# Altium project BLUENRG-345_REV1_PT1.PrjPcb
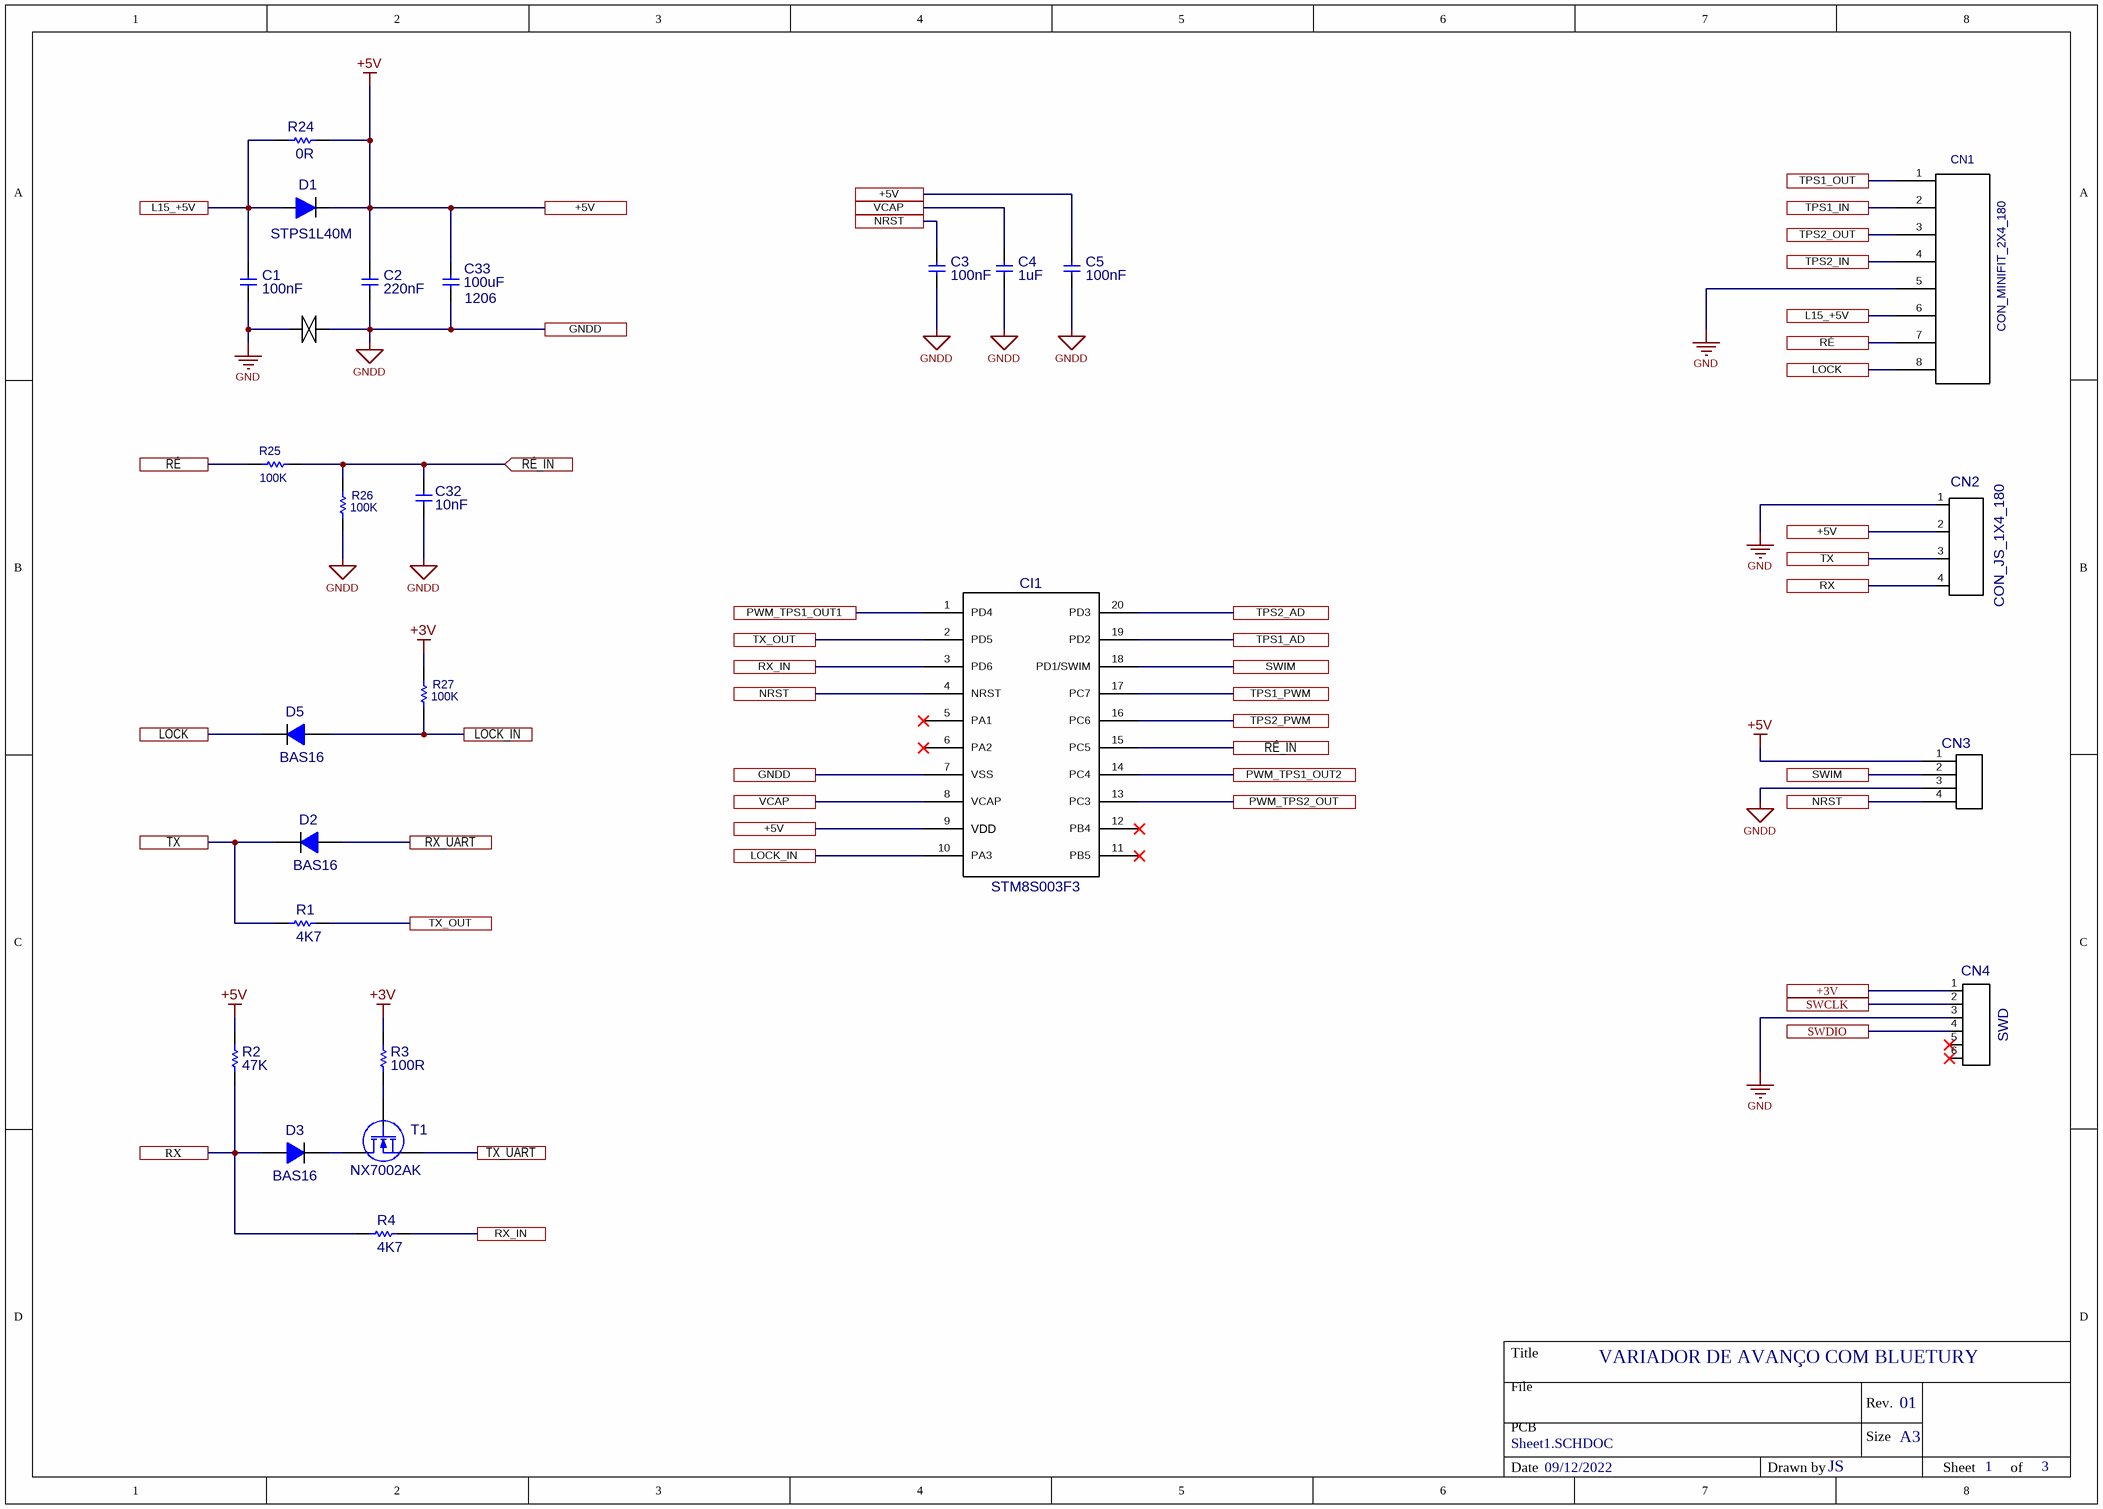
[diagram p0: BLUENRG-345_REV1_Sheet1.SchDoc]
Date: 09/12/2022; DrawnBy: JS; Revision: 01; Title: VARIADOR DE AVANÇO COM BLUETURY
3 sheets, 82 parts. Net scope: flat (ports and power ports of the same name join across sheets).
Board files: BLUENRG-345_REV1_PAINEL.PcbDoc, BLUENRG-345_REV1_PT1_UN.PcbDoc
Sheets:
  BLUENRG-345_REV1_Sheet1.SchDoc
  BLUENRG-345_REV1_Sheet2.SchDoc
  BLUENRG-345_REV1_Sheet3.SchDoc

## Sheet BLUENRG-345_REV1_Sheet1.SchDoc: VARIADOR DE AVANÇO COM BLUETURY
size A3; Date: 09/12/2022; Author: FELIPE; DrawnBy: JS; DocumentNumber: 1; Revision: 01; SheetNumber: 1; SheetTotal: 3; DocumentName: Sheet1.SCHDOC

### Parts
C1  value 100nF  [C0402_REV1]  (hidden comment: C0402)
C2  value 220nF  [C0402_REV1]  (hidden comment: C0402)
C3  value 100nF  [C0402_REV1]  (hidden comment: C0402)
C4  value 1uF  [C0402_REV1]  (hidden comment: C0402)
C5  value 100nF  [C0402_REV1]  (hidden comment: C0402)
C32  value 10nF  [C0402_REV1]  (hidden comment: C0402)
C33  value 100uF  Encapsulamento: 1206  [C1206_rev1]  (hidden comment: C1206)
CI1  value STM8S003F3  [TSSOP20]  (hidden comment: CI_STM8S003F3_TSSOP20)
CN1  CON_MINIFIT_2X4_180  [CONECTOR_MINIFIT_2X4_180]
CN2  CON_JS_1X4_180  [CONECTOR_ 1x4 2.0mm - 180°]
CN3  CON_BP1X4_180  [CONECTOR_BP1X4_SWIM_180]  (value not drawn)
CN4  value SWD  [CONECTOR_BP1X6_180]  (hidden comment: CON_BP1X6_180)
D1  value STPS1L40M  [DO216AA_REV1]  (hidden comment: D_STPS1L40M_DO216AA)
D2  value BAS16  [SOD323_IPC]  (hidden comment: D_BAS16_SOD323)
D3  value BAS16  [SOD323_IPC]  (hidden comment: D_BAS16_SOD323)
D5  value BAS16  [SOD323_IPC]  (hidden comment: D_BAS16_SOD323)
NT1  NET TIE 30mils  [NET TIE 30mils]  (value not drawn)  (net tie, no BOM)
R1  value 4K7  [R0402_REV1]  (hidden comment: RES 0402 4K7 1/16W 5%)
R2  value 47K  [R0402_REV1]  (hidden comment: R0603)
R3  value 100R  [R0402_REV1]  (hidden comment: R0603)
R4  value 4K7  [R0402_REV1]  (hidden comment: RES 0402 4K7 1/16W 5%)
R24  value 0R  [R0402_REV1]  (hidden comment: RES 0402 0R 1/16W 5%)
R25  value 100K  [R0402_REV1]  (hidden comment: R0402)
R26  value 100K  [R0402_REV1]  (hidden comment: R0402)
R27  value 100K  [R0402_REV1]  (hidden comment: R0402)
T1  NX7002AK  [SOT23_REV1]

### Ports
+3V, +5V, GNDD, L15_+5V, LOCK, LOCK_IN, NRST, PWM_TPS1_OUT1, PWM_TPS1_OUT2, PWM_TPS2_OUT, RX, RX_IN, RX_UART, RÉ, RÉ_IN, RÉ_IN (in), SWCLK, SWDIO, SWIM, TPS1_AD, TPS1_IN, TPS1_OUT, TPS1_PWM, TPS2_AD, TPS2_IN, TPS2_OUT, TPS2_PWM, TX, TX_OUT, TX_UART, VCAP

### Nets
+3V: CN4.1 R3.2 R27.1 ; port +3V
+5V: C2.1 C5.1(+) C33.2 CI1.9(VDD) CN2.2 CN3.1 D1.1(K) R2.2 R24.1 ; port +5V
GND: C1.2(-) CN1.5 CN2.1 CN4.3 NT1.2
GNDD: C2.2 C3.2(-) C4.2 C5.2(-) C32.1 C33.1 CI1.7(VSS) CN3.3 NT1.1 R26.2 ; port GNDD
L15_+5V: C1.1(+) CN1.6 D1.2(A) R24.2 ; port L15_+5V
LOCK: CN1.8 D5.2(K) ; port LOCK
LOCK_IN: CI1.10(PA3) D5.1(A) R27.2 ; port LOCK_IN
NRST: C3.1(+) CI1.4(NRST) CN3.4 ; port NRST
PWM_TPS1_OUT1: CI1.1(PD4) ; port PWM_TPS1_OUT1
PWM_TPS1_OUT2: CI1.14(PC4) ; port PWM_TPS1_OUT2
PWM_TPS2_OUT: CI1.13(PC3) ; port PWM_TPS2_OUT
RX: CN2.4 D3.1(A) R2.1 R4.1 ; port RX
RX_IN: CI1.3(PD6) R4.2 ; port RX_IN
RX_UART: D2.1(A) ; port RX_UART
RÉ: CN1.7 R25.2 ; port RÉ
RÉ_IN: C32.2 CI1.15(PC5) R25.1 R26.1 ; port RÉ_IN
SWCLK: CN4.2 ; port SWCLK
SWDIO: CN4.4 ; port SWDIO
SWIM: CI1.18(PD1/SWIM) CN3.2 ; port SWIM
TPS1_AD: CI1.19(PD2) ; port TPS1_AD
TPS1_IN: CN1.2 ; port TPS1_IN
TPS1_OUT: CN1.1 ; port TPS1_OUT
TPS1_PWM: CI1.17(PC7) ; port TPS1_PWM
TPS2_AD: CI1.20(PD3) ; port TPS2_AD
TPS2_IN: CN1.4 ; port TPS2_IN
TPS2_OUT: CN1.3 ; port TPS2_OUT
TPS2_PWM: CI1.16(PC6) ; port TPS2_PWM
TX: CN2.3 D2.2(K) R1.1 ; port TX
TX_OUT: CI1.2(PD5) R1.2 ; port TX_OUT
TX_UART: T1.2(S) ; port TX_UART
VCAP: C4.1 CI1.8(VCAP) ; port VCAP
NetD3_2: D3.2(K) T1.3(D)
NetR3_1: R3.1 T1.1(G)

Not connected (* = marked no-connect by the designer): CI1 5(PA1)* 6(PA2)* 11(PB5)* 12(PB4)*; CN4 5* 6*

### Notes on the sheet
- Title
- File
- PCB
- Rev.
- Size
- A3
- Date
- Drawn by
- Sheet
- of

### Library data of the parts
C1 C3 C5 = CAP_0402 100nF 10% 50V X7R: CAPACITOR 0402 100NF / 50V X7R 10%; Partnumber Fabricante 01: GCM155R71H104KE02D; Código Tury: 002.00.00015; Tipo de Montagem: SMD; Fabricante 01: MURATA; Fabricante 02: YAGEO; Partnumber Fabricante 02: CC0402KRX5R9BB104
C2 = CAP_0402 220nF 10% 16V X7R: CAPACITOR 0402 220NF / 16V X7R 10%; Partnumber Fabricante 01: GRM155R71H224KA12D; Tipo de Montagem: SMD; Código Tury: 002.00.00014; Fabricante 01: MURATA; Fabricante 02: YAGEO; Fabricante 03: TAIYO-YUDEN; Partnumber Fabricante 02: CC0402KRX7R8BB224; Partnumber Fabricante 03: UMK105BJ224KV-F
C4 = CAP_0402 1uF 10% 16V X6S: CAPACITOR 0402 1UF / 16V X6S 10%; Partnumber Fabricante 01: EMK105C6105KV-F; Tipo de Montagem: SMD; Código Tury: 002.00.00009; Fabricante 01: TAIYO-YUDEN; Fabricante 02: YAGEO; Fabricante 03: TDK; Partnumber Fabricante 02: CC0402KRX6S7BB105; Partnumber Fabricante 03: C1005X6S1C105K050BC
C32 = CAP 0603 47nF 50V X7R 10%: CAPACITOR 0402 10NF / 25V X7R 5%; Partnumber Fabricante 01: GRM155R71E103JA01J; Código Tury: 002.00.00007; Tipo de Montagem: SMD; Fabricante 01: MURATA; Fabricante 02: YAGEO; Fabricante 03: YAGEO; Partnumber Fabricante 02: CC0402KRX7R8BB103; Partnumber Fabricante 03: CC0402JRX7R8BB103
C33 = CAP_1206 100uF 6V3 X5R 20%: CAPACITOR 1206 100UF / 6V3 X5R 20%; Partnumber Fabricante 01: GMC31X5R107M6R3NT; Código Tury: 002.03.00006; Tipo de Montagem: SMD; Fabricante 01: CAL-CHIP ELECTRONICS, INC.
CI1 = CI_STM8S003F3_TSSOP20: CI MICROCONTROLADOR STM8S003F3P6; Partnumber Fabricante 01: STM8S003F3P6TR; Código Tury: 004.07.00026; Tipo de Montagem: SMD; Fabricante 01: ST
CN1 = CONECTOR_MINIFIT_2X4_180_PT: CONECTOR PCI - POTENCIA MINIFIT PT 180° 2X4X4,2MM; Tipo de Montagem: PTH; Código Tury: 014.11.00221; Value: *
CN2 = CONECTOR_JS_1X4_180: CONECTOR PCI - SINAL 180° - 1X4X2,0MM; Partnumber Fabricante 01: LW-2002P0400T; Tipo de Montagem: PTH; Código Tury: 014.10.00819; Fabricante 01: LANDWIN; Value: *
CN3 = CON_BPT_1X4_180: BARRA DE PINO - SECAO QUADRADA 180º 1X4X2,54MM; Part Number: 013.07.00104; Tipo de Montagem: PTH
CN4 = CONECTOR_BP1X6_180: Conector barra de pinos 1x6 180º; Part Number: 013.07.00108
D1 = D_STPS1L40M_DO216AA: DIODO SCHOTTKY STPS1L40M DO2126-AA; Código Tury: 005.04.00002; Tipo de Montagem: SMD
D2 D3 D5 = D_BAS16_SOD323: DIODO DE SINAL BAS16 SOD323; Partnumber Fabricante 01: BAS316; Tipo de Montagem: SMD; Código Tury: 005.00.00010; Fabricante 01: NXP; Fabricante 02: ON; Fabricante 03: VISHAY; Partnumber Fabricante 02: BAS16HT1G; Partnumber Fabricante 03: BAS16WS
NT1 = NET TIE 30mils: Value: {Value}
R1 R4 = RES 0402 4K7 1/16W 5%: RESISTOR 0402 4K7 1/16W 5%; Partnumber Fabricante 01: CRCW04024K70JNED; Código Tury: 001.00.00009; Encapsulamento: 0402; Tipo de Montagem: SMD; Fabricante 02: VIKING; Fabricante 01: VISHAY; Fabricante 03: WALSIN; Partnumber Fabricante 02: CR-02JL6---4K7; Partnumber Fabricante 03: WR04X472JTL
R2 = RES 0402 47K 1/16W 5%: RESISTOR 0402 47K 1/16W 5%; Partnumber Fabricante 01: CRCW040247K0JNEDHP; Encapsulamento: 0402; Tipo de Montagem: SMD; Código Tury: 001.00.00006; Fabricante 01: VISHAY; Fabricante 02: VIKING; Fabricante 03: HOTTECH; Partnumber Fabricante 02: CR-02JL6--47K; Partnumber Fabricante 03: RI0402L473JT
R3 = RES 0402 100R 1/16W 5%: RESISTOR 0402 100R 1/16W 5%; Partnumber Fabricante 01: CR0402AJW-101GAS; Encapsulamento: 0402; Tipo de Montagem: SMD; Código Tury: 001.00.00001; Fabricante 01: BOURNS; Fabricante 02: VIKING; Fabricante 03: WALSIN; Partnumber Fabricante 02: CR-02JL6--100R; Partnumber Fabricante 03: WR04X101JTL
R24 = RES 0402 0R 1/16W 5%: RESISTOR 0402 0R 1/16W 5%; Partnumber Fabricante 01: RC0402JR-070RL; Encapsulamento: 0402; Tipo de Montagem: SMD; Código Tury: 001.00.00024; Fabricante 01: YAGEO; Fabricante 02: WALSIN; Partnumber Fabricante 02: MR04X000PTL
R25-R27 = RES 0402 100K 1/16W 5%: RESISTOR 0402 100K 1/16W 5%; Partnumber Fabricante 01: CRCW0402100KJNED; Encapsulamento: 0402; Tipo de Montagem: SMD; Código Tury: 001.00.00005; Fabricante 01: VISHAY; Fabricante 02: VIKING; Fabricante 03: WALSIN; Partnumber Fabricante 02: CR-02JL6--100K; Partnumber Fabricante 03: WR04X104JTL
T1 = T_NX7002AK: TRANSISTOR MOSFET CANAL N 60V ,19A NX7002AK; Tipo de Montagem: SMD; Código Tury: 006.06.00013; Value: NX7002AK

## Sheet BLUENRG-345_REV1_Sheet2.SchDoc: VARIADOR DE AVANÇO COM BLUETURY
size A3; Date: 09/12/2022; Author: FELIPE; DrawnBy: JS; DocumentNumber: 2; Revision: 01; SheetNumber: 2; SheetTotal: 3; DocumentName: Sheet2.SCHDOC
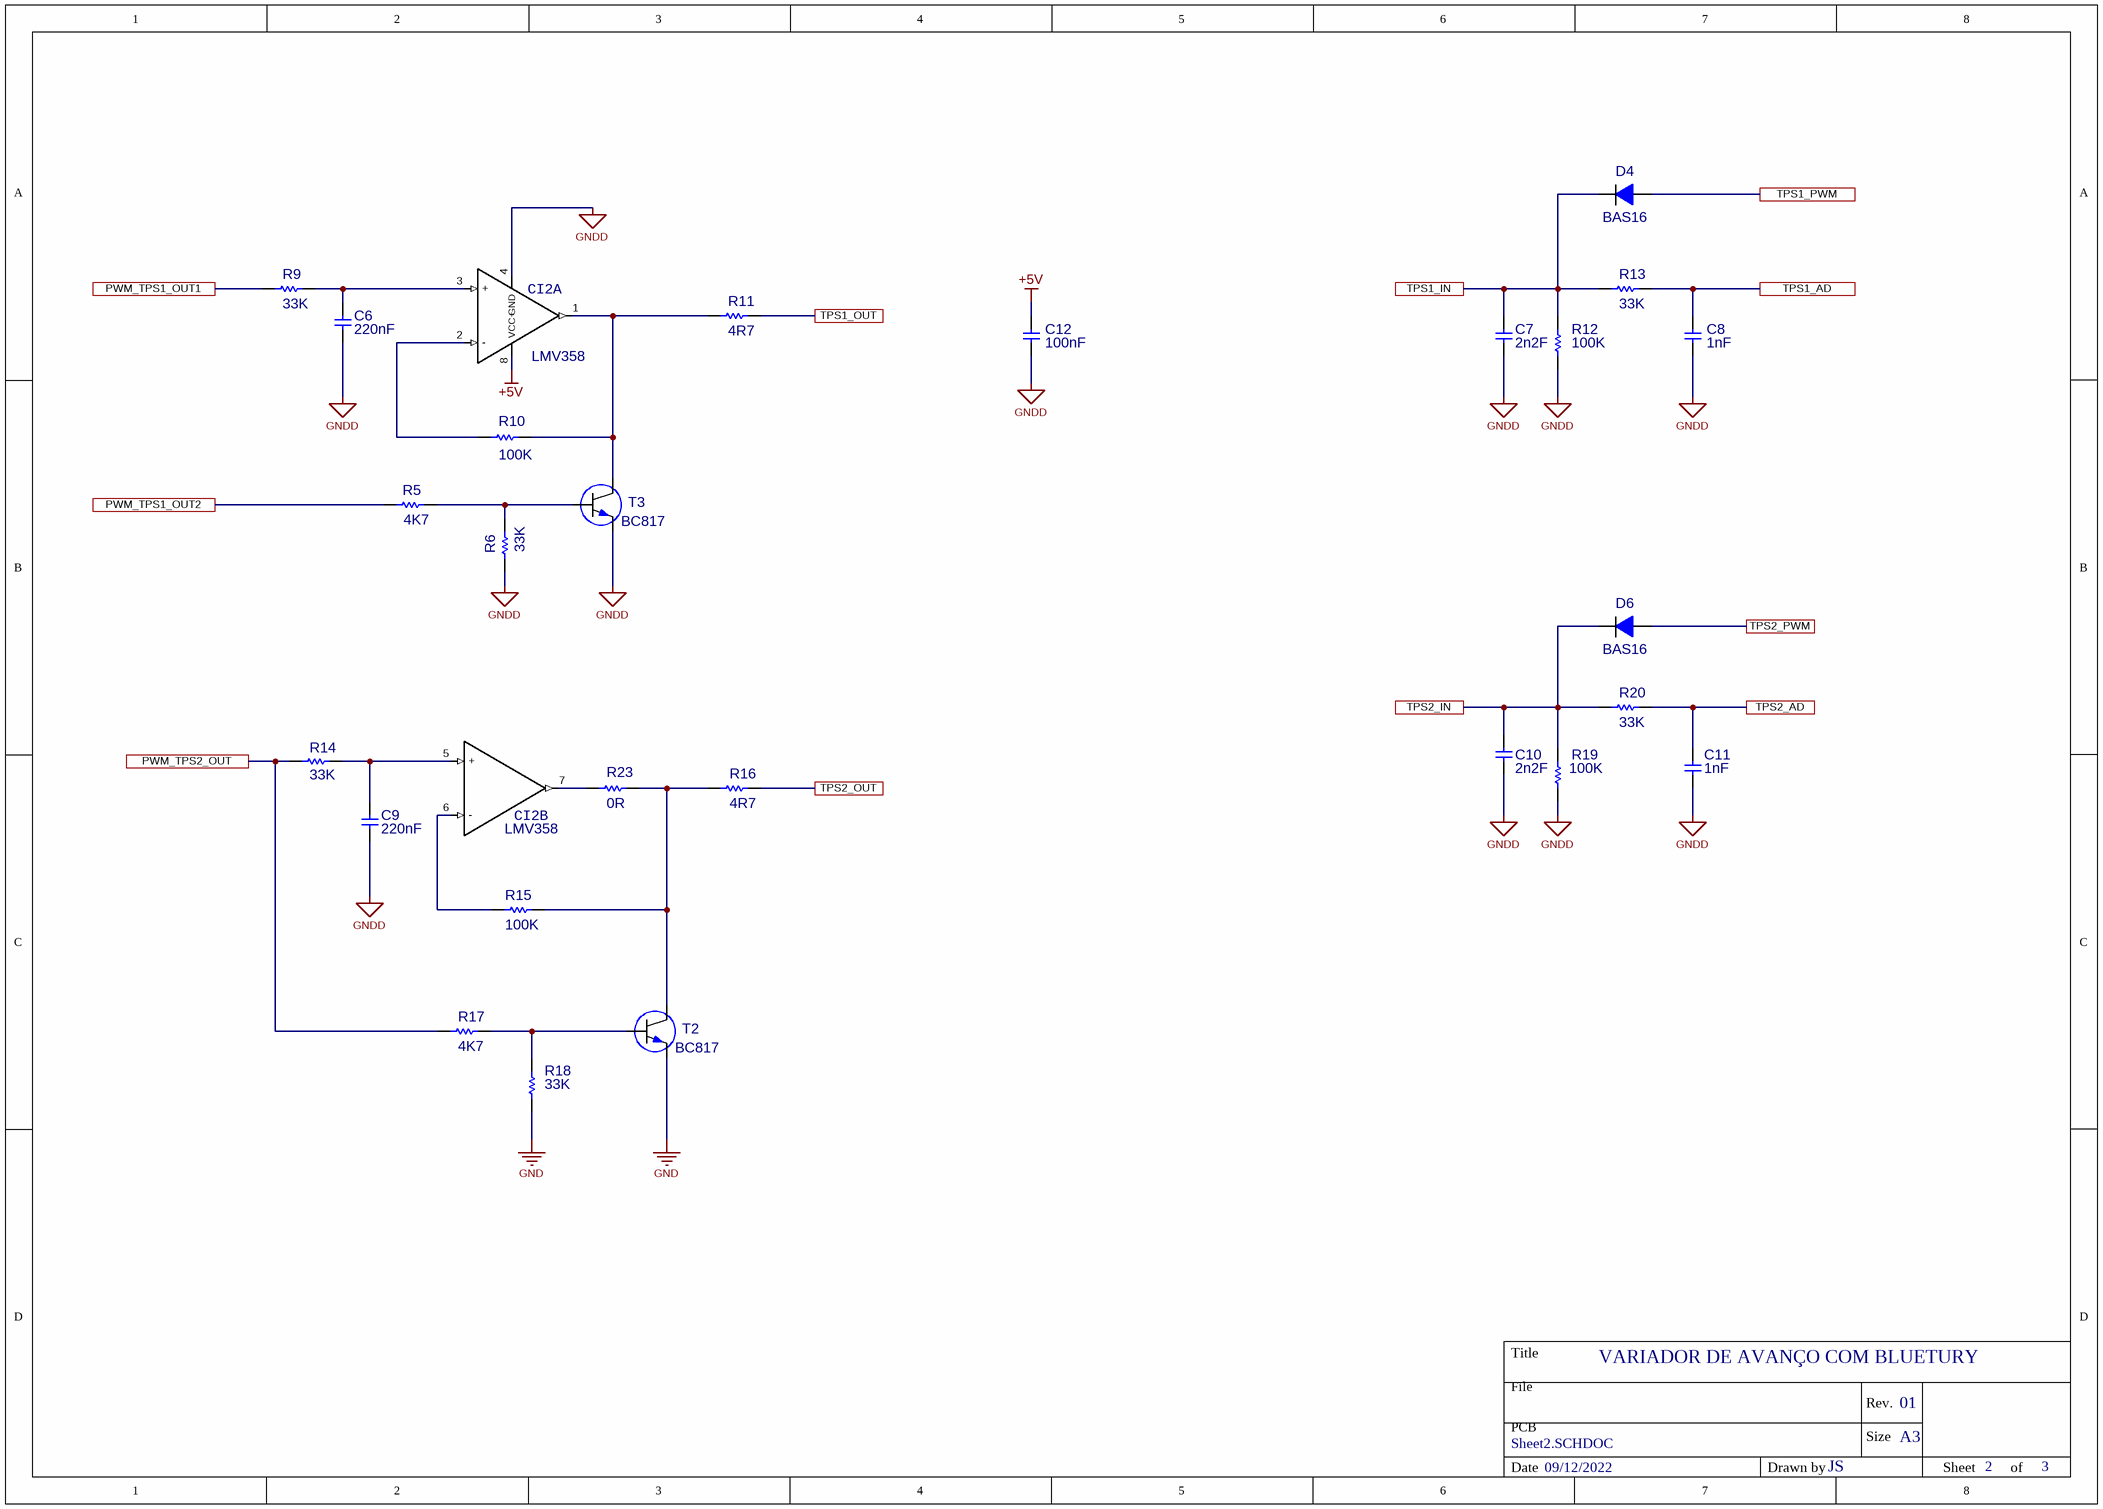
[diagram p1: BLUENRG-345_REV1_Sheet2.SchDoc]

### Parts
C6  value 220nF  [C0402_REV1]  (hidden comment: C0402)
C7  value 2n2F  [C0402_REV1]  (hidden comment: C0402)
C8  value 1nF  [C0402_REV1]  (hidden comment: C0402)
C9  value 220nF  [C0402_REV1]  (hidden comment: C0402)
C10  value 2n2F  [C0402_REV1]  (hidden comment: C0402)
C11  value 1nF  [C0402_REV1]  (hidden comment: C0402)
C12  value 100nF  [C0402_REV1]  (hidden comment: C0402)
CI2  value LMV358  [TSSOP-8_REV1 - MINISO8]  (hidden comment: CI_LMV358_TSSOP8)  (parts A,B of 2)
D4  value BAS16  [SOD323_IPC]  (hidden comment: D_BAS16_SOD323)
D6  value BAS16  [SOD323_IPC]  (hidden comment: D_BAS16_SOD323)
R5  value 4K7  [R0402_REV1]  (hidden comment: RES 0402 4K7 1/16W 5%)
R6  value 33K  [R0402_REV1]  (hidden comment: R0603)
R9  value 33K  [R0402_REV1]  (hidden comment: R0603)
R10  value 100K  [R0402_REV1]  (hidden comment: R0402)
R11  value 4R7  [R0402_REV1]  (hidden comment: RES 0402 4R7 1/16W 5%)
R12  value 100K  [R0402_REV1]  (hidden comment: R0402)
R13  value 33K  [R0402_REV1]  (hidden comment: R0603)
R14  value 33K  [R0402_REV1]  (hidden comment: R0603)
R15  value 100K  [R0402_REV1]  (hidden comment: R0402)
R16  value 4R7  [R0402_REV1]  (hidden comment: RES 0402 4R7 1/16W 5%)
R17  value 4K7  [R0402_REV1]  (hidden comment: RES 0402 4K7 1/16W 5%)
R18  value 33K  [R0402_REV1]  (hidden comment: R0603)
R19  value 100K  [R0402_REV1]  (hidden comment: R0402)
R20  value 33K  [R0402_REV1]  (hidden comment: R0603)
R23  value 0R  [R0402_REV1]  (hidden comment: RES 0402 0R 1/16W 5%)
T2  BC817  [SOT23_REV1]
T3  BC817  [SOT23_REV1]

### Ports
PWM_TPS1_OUT1, PWM_TPS1_OUT2, PWM_TPS2_OUT, TPS1_AD, TPS1_IN, TPS1_OUT, TPS1_PWM, TPS2_AD, TPS2_IN, TPS2_OUT, TPS2_PWM

### Nets
+5V: C12.2(-) CI2.8(VCC+)
GND: R18.1 T2.2(E)
GNDD: C6.1 C7.2 C8.2 C9.1 C10.2 C11.2 C12.1(+) CI2.4(GND) R6.1 R12.1 R19.1 T3.2(E)
PWM_TPS1_OUT1: R9.1 ; port PWM_TPS1_OUT1
PWM_TPS1_OUT2: R5.1 ; port PWM_TPS1_OUT2
PWM_TPS2_OUT: R14.1 R17.1 ; port PWM_TPS2_OUT
TPS1_AD: C8.1 R13.2 ; port TPS1_AD
TPS1_IN: C7.1 D4.2(K) R12.2 R13.1 ; port TPS1_IN
TPS1_OUT: R11.2 ; port TPS1_OUT
TPS1_PWM: D4.1(A) ; port TPS1_PWM
TPS2_AD: C11.1 R20.2 ; port TPS2_AD
TPS2_IN: C10.1 D6.2(K) R19.2 R20.1 ; port TPS2_IN
TPS2_OUT: R16.2 ; port TPS2_OUT
TPS2_PWM: D6.1(A) ; port TPS2_PWM
NetC6_2: C6.2 CI2.3(+) R9.2
NetC9_2: C9.2 CI2.5(+) R14.2
NetCI2_1: CI2.1(OUT) R10.2 R11.1 T3.3(C)
NetCI2_2: CI2.2(-) R10.1
NetCI2_6: CI2.6(-) R15.1
NetCI2_7: CI2.7(OUT) R23.1
NetR5_2: R5.2 R6.2 T3.1(B)
NetR15_2: R15.2 R16.1 R23.2 T2.3(C)
NetR17_2: R17.2 R18.2 T2.1(B)

### Notes on the sheet
- Title
- File
- PCB
- Rev.
- Size
- A3
- Date
- Drawn by
- Sheet
- of

### Library data of the parts
C6 C9 = CAP_0402 220nF 10% 16V X7R: CAPACITOR 0402 220NF / 16V X7R 10%; Partnumber Fabricante 01: GRM155R71H224KA12D; Código Tury: 002.00.00014; Tipo de Montagem: SMD; Fabricante 01: MURATA; Fabricante 02: YAGEO; Fabricante 03: TAIYO-YUDEN; Partnumber Fabricante 02: CC0402KRX7R8BB224; Partnumber Fabricante 03: UMK105BJ224KV-F
C7 C10 = CAP_0402 2n2F 5% 50V X7R: CAPACITOR 0402 2n2F / 50V C0G 5%; Tipo de Montagem: SMD; Código Tury: 002.00.00017
C8 C11 = CAP_0402 1nF 5% 50V X7R: CAPACITOR 0402 1NF / 50V C0G 5%; Partnumber Fabricante 01: GRT1555C1H102JA02D; Tipo de Montagem: SMD; Código Tury: 002.00.00004; Fabricante 01: MURATA; Fabricante 02: SAMSUNGEM; Fabricante 03: YAGEO; Partnumber Fabricante 02: CL05B102KB5NNNC; Partnumber Fabricante 03: CC0402JRNP09BN102
C12 = CAP_0402 100nF 10% 50V X7R: as C1 on sheet BLUENRG-345_REV1_Sheet1; Partnumber Fabricante 02: CC0402KRX5R9BB104
CI2 = CI_LMV358_TSSOP8: CI AMPLIFICADOR OPERACIONAL LMV358IPT TSSOP8; Tipo de Montagem: SMD; Código Tury: 004.00.00011; Fabricante 01: ST; Encapsulamento: TSSOP8; Partnumber Fabricante 01: LMV358IPT
D4 D6 = D_BAS16_SOD323: DIODO DE SINAL BAS16 SOD323; Partnumber Fabricante 01: BAS316; Código Tury: 005.00.00010; Tipo de Montagem: SMD; Fabricante 01: NXP; Fabricante 02: ON; Fabricante 03: VISHAY; Partnumber Fabricante 02: BAS16HT1G; Partnumber Fabricante 03: BAS16WS
R5 R17 = RES 0402 4K7 1/16W 5%: as R1 on sheet BLUENRG-345_REV1_Sheet1; Partnumber Fabricante 02: CR-02JL6---4K7; Partnumber Fabricante 03: WR04X472JTL
R6 R9 R14 R18 = RES 0402 33K 1/16W 5%: RESISTOR 0402 33K 1/16W 5%; Partnumber Fabricante 01: CRCW040233K0JNEDC; Código Tury: 001.00.00023; Encapsulamento: 0402; Tipo de Montagem: SMD; Fabricante 01: VISHAY
R10 R15 = RES 0402 100K 1/16W 5%: as R25 on sheet BLUENRG-345_REV1_Sheet1; Partnumber Fabricante 02: CR-02JL6--100K; Partnumber Fabricante 03: WR04X104JTL
R11 R16 = RES 0402 4R7 1/16W 5%: RESISTOR 0402 4R7 1/16W 5%; Partnumber Fabricante 01: CRCW04024R70JNED; Código Tury: 001.00.00011; Encapsulamento: 0402; Tipo de Montagem: SMD; Fabricante 01: VISHAY; Fabricante 02: VIKING; Fabricante 03: FENGHUA; Partnumber Fabricante 02: CR-02JL6--4R7; Partnumber Fabricante 03: RC-02U4R7JT
R12 R19 = RES 0402 100K 1/16W 5%: RESISTOR 0402 100K 1/16W 5%; Partnumber Fabricante 01: CRCW0402100KJNED; Código Tury: 001.00.00005; Encapsulamento: 0402; Tipo de Montagem: SMD; Fabricante 01: VISHAY; Fabricante 02: VIKING; Fabricante 03: WALSIN; Partnumber Fabricante 02: CR-02JL6--100K; Partnumber Fabricante 03: WR04X104JTL
R13 R20 = RES 0402 33K 1/16W 5%: RESISTOR 0402 33K 1/16W 5%; Partnumber Fabricante 01: CRCW040233K0JNEDC; Encapsulamento: 0402; Tipo de Montagem: SMD; Código Tury: 001.00.00023; Fabricante 01: VISHAY
R23 = RES 0402 0R 1/16W 5%: RESISTOR 0402 0R 1/16W 5%; Partnumber Fabricante 01: RC0402JR-070RL; Código Tury: 001.00.00024; Encapsulamento: 0402; Tipo de Montagem: SMD; Fabricante 01: YAGEO; Fabricante 02: WALSIN; Partnumber Fabricante 02: MR04X000PTL
T2 T3 = T_BC817_SOT23: TRANSISTOR BIPOLAR DE SINAL BC817/40  SOT23; Partnumber Fabricante 01: BC817-40LT1G; Código Tury: 006.00.00004; Tipo de Montagem: SMD; Fabricante 01: ON; Fabricante 02: NXP; Value: BC817; Encapsulamento: SOT23; Partnumber Fabricante 02: BC817-40,215

## Sheet BLUENRG-345_REV1_Sheet3.SchDoc: VARIADOR DE AVANÇO COM BLUETURY
size A3; Date: 09/12/2022; DrawnBy: JS; Organization: Altium Limited; Address1: L3, 12a Rodborough Rd; Address2: Frenchs Forest; Address3: NSW; Address4: Australia 2086; Revision: 01; SheetNumber: 3; SheetTotal: 3
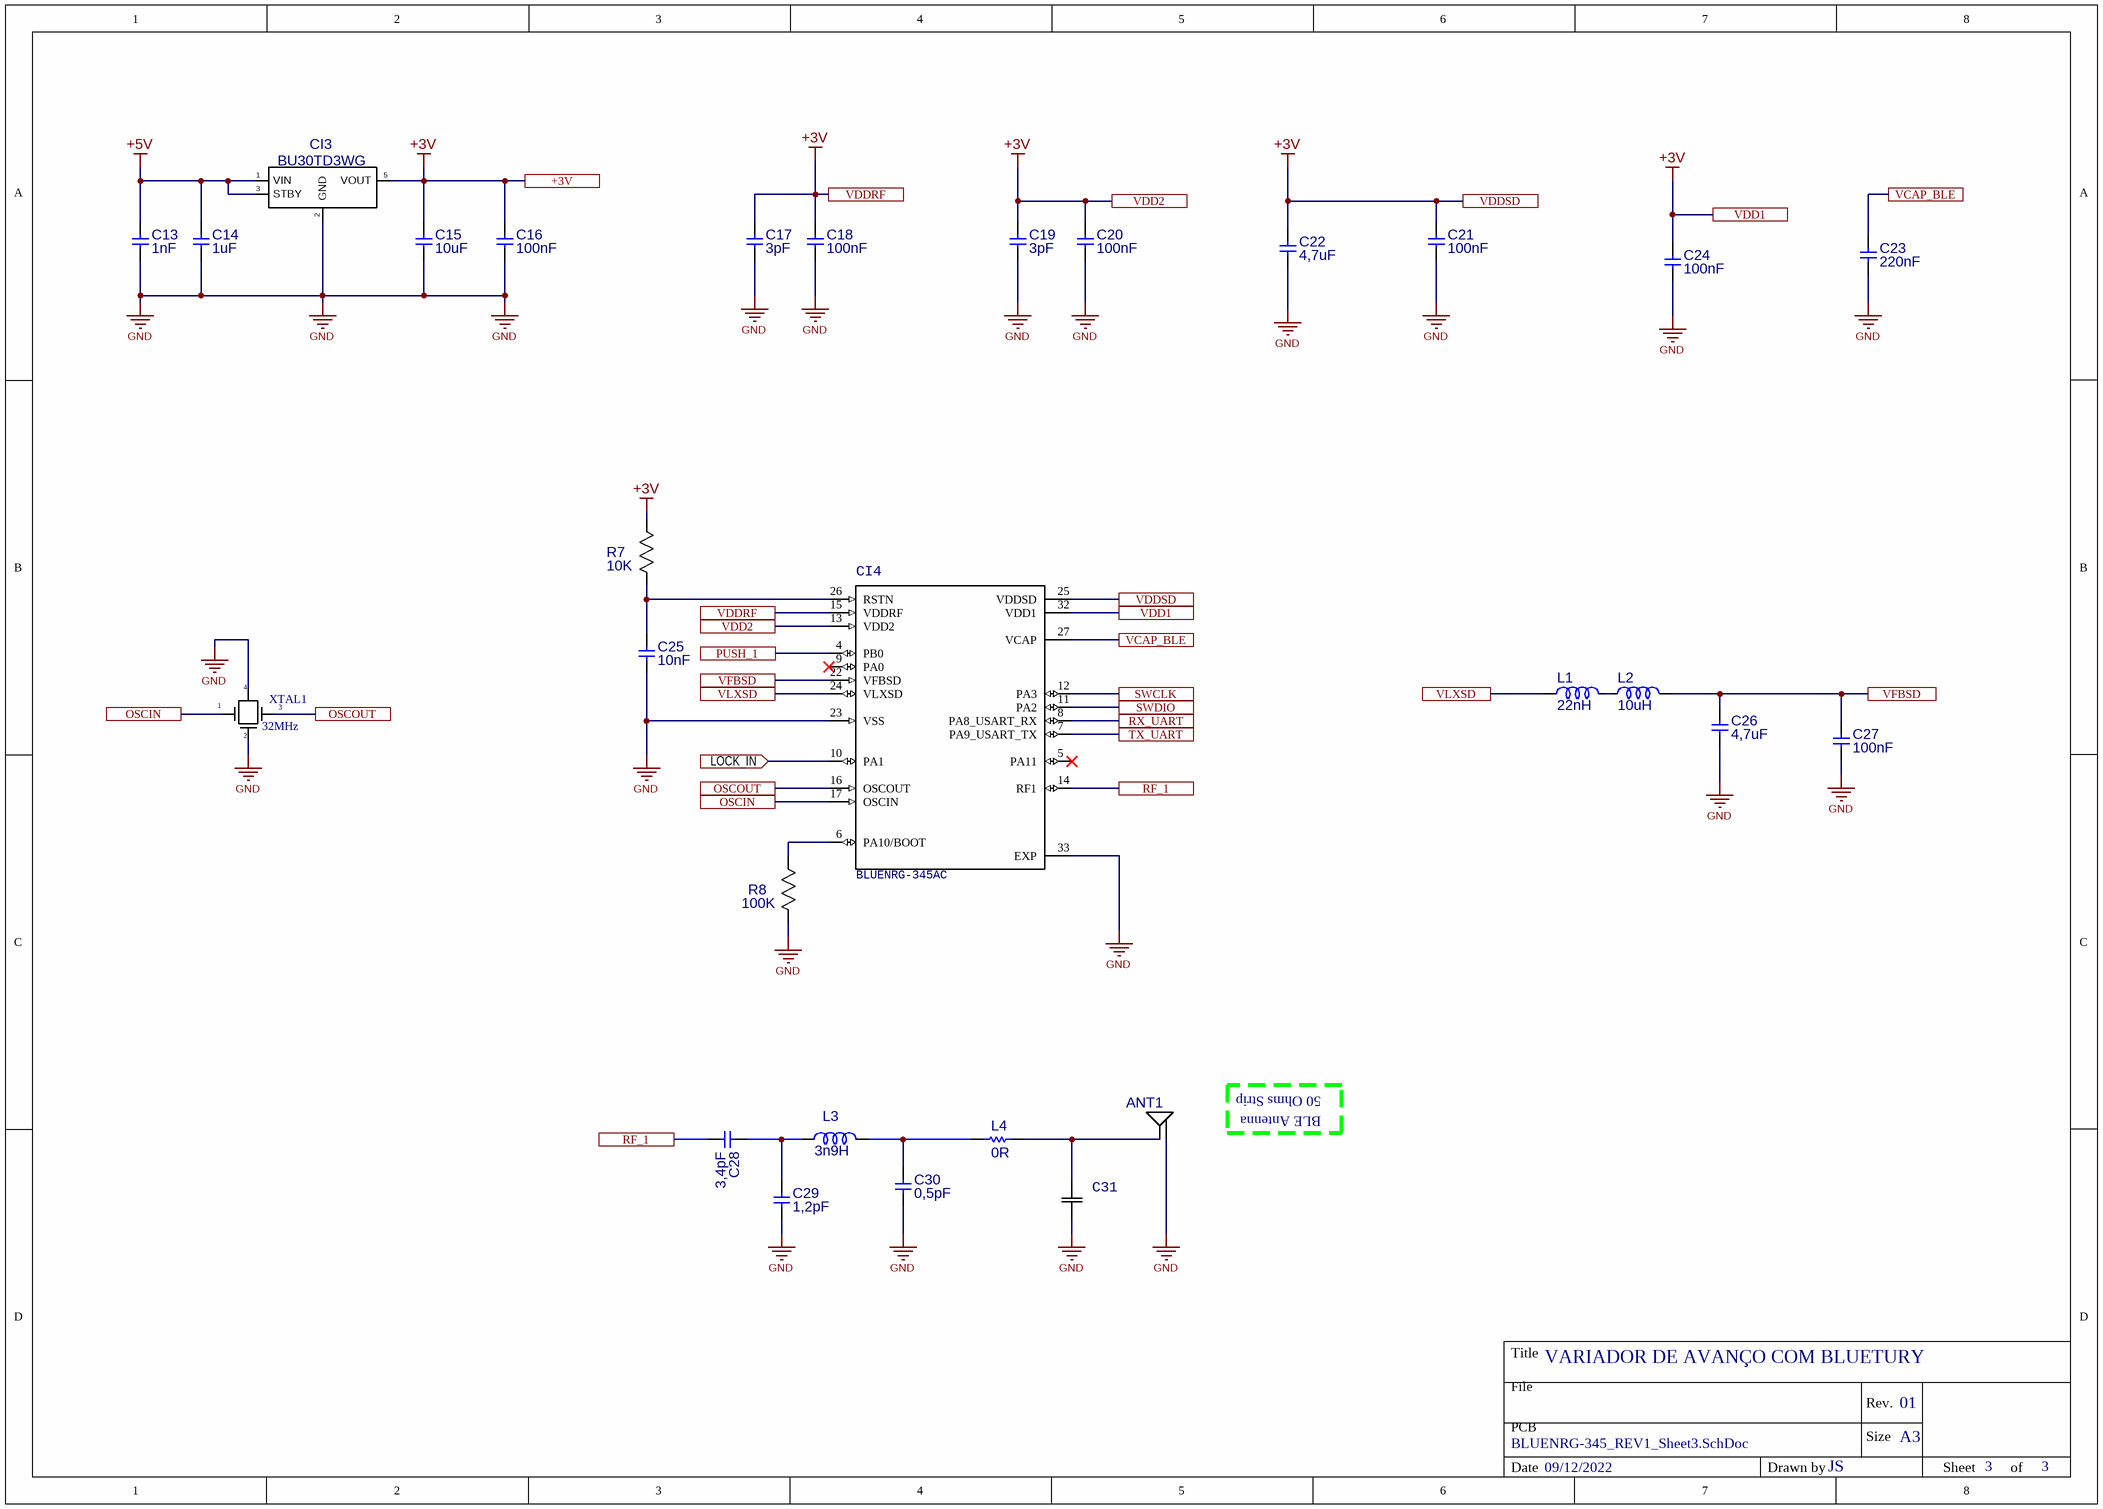
[diagram p2: BLUENRG-345_REV1_Sheet3.SchDoc]

### Parts
ANT1  Antenna_Bluetury  [Antenna_PCB_Bluetury]  (value not drawn)  (net tie, no BOM)
C13  value 1nF  [C0402_REV1]  (hidden comment: C0402)
C14  value 1uF  [C0402_REV1]  (hidden comment: C0402)
C15  value 10uF  [C0402_REV1]  (hidden comment: C0402)
C16  value 100nF  [C0402_REV1]  (hidden comment: C0402)
C17  value 3pF  [C0402_REV1]  (hidden comment: C0402)
C18  value 100nF  [C0402_REV1]  (hidden comment: C0402)
C19  value 3pF  [C0402_REV1]  (hidden comment: C0402)
C20  value 100nF  [C0402_REV1]  (hidden comment: C0402)
C21  value 100nF  [C0402_REV1]  (hidden comment: C0402)
C22  value 4,7uF  [C0402_REV1]  (hidden comment: C0402)
C23  value 220nF  [C0402_REV1]  (hidden comment: C0402)
C24  value 100nF  [C0402_REV1]  (hidden comment: C0402)
C25  value 10nF  [C0402_REV1]  (hidden comment: C0402)
C26  value 4,7uF  [C0402_REV1]  (hidden comment: C0402)
C27  value 100nF  [C0402_REV1]  (hidden comment: C0402)
C28  value 3,4pF  [C0402_REV1]  (hidden comment: C0402)
C29  value 1,2pF  [C0402_REV1]  (hidden comment: C0402)
C30  value 0,5pF  [C0402_REV1]  (hidden comment: C0402)
C31  C0603  [C0402_REV1]  (value not drawn)
CI3  BU30TD3WG  [SOT23-5L]
CI4  BLUENRG-345AC  [QFN33]
L1  value 22nH  [L0402_REV1]  (hidden comment: IND 0402 22nH)
L2  value 10uH  [C0603_REV1]  (hidden comment: IND 0603 10uH)
L3  value 3n9H  [L0402_REV1]  (hidden comment: IND 0402 3n9H)
L4  value 0R  [R0402_REV1]  (hidden comment: RES 0402 0R 1/16W 5%)
R7  value 10K  [R0402_REV1]  (hidden comment: R0402)
R8  value 100K  [R0402_REV1]  (hidden comment: R0402)
XTAL1  value 32MHz  [CX2016DB]  (hidden comment: XTAL_CX2016DB)

### Ports
+3V, LOCK_IN (in), OSCIN, OSCOUT, PUSH_1, RF_1, RX_UART, SWCLK, SWDIO, TX_UART, VCAP_BLE, VDD1, VDD2, VDDRF, VDDSD, VFBSD, VLXSD

### Nets
+3V: C15.2 C16.2(-) C17.2 C18.2(-) C19.2 C20.2(-) C21.2(-) C22.2 C24.2(-) CI3.5(VOUT) CI4.13(VDD2) CI4.15(VDDRF) CI4.25(VDDSD) CI4.32(VDD1) R7.1(A) ; port +3V, port VDDRF, port VDD2, port VDDSD, port VDD1
+5V: C13.2 C14.2 CI3.1(VIN) CI3.3(STBY)
GND: ANT1.2(Feed) C13.1 C14.1 C15.1 C16.1(+) C17.1 C18.1(+) C19.1 C20.1(+) C21.1(+) C22.1 C23.1 C24.1(+) C25.1 C26.1 C27.1(+) C29.1 C30.1 C31.2 CI3.2(GND) CI4.23(VSS) CI4.33(EXP) R8.2(B) XTAL1.2 XTAL1.4
LOCK_IN: CI4.10(PA1) ; port LOCK_IN
OSCIN: CI4.17(OSCIN) XTAL1.1 ; port OSCIN
OSCOUT: CI4.16(OSCOUT) XTAL1.3 ; port OSCOUT
PUSH_1: CI4.4(PB0) ; port PUSH_1
RF_1: C28.1 CI4.14(RF1) ; port RF_1
RX_UART: CI4.8(PA8_USART_RX) ; port RX_UART
SWCLK: CI4.12(PA3) ; port SWCLK
SWDIO: CI4.11(PA2) ; port SWDIO
TX_UART: CI4.7(PA9_USART_TX) ; port TX_UART
VCAP_BLE: C23.2 CI4.27(VCAP) ; port VCAP_BLE
VFBSD: C26.2 C27.2(-) CI4.22(VFBSD) L2.2 ; port VFBSD
VLXSD: CI4.24(VLXSD) L1.1 ; port VLXSD
NetANT1_1: ANT1.1(Feed) C31.1 L4.1
NetC25_2: C25.2 CI4.26(RSTN) R7.2(B)
NetC28_2: C28.2 C29.2 L3.1
NetC30_2: C30.2 L3.2 L4.2
NetCI4_6: CI4.6(PA10/BOOT) R8.1(A)
NetL1_2: L1.2 L2.1

Not connected (* = marked no-connect by the designer): CI3 4(NC); CI4 5(PA11)* 9(PA0)*

### Notes on the sheet
- 50 Ohms Strip
- BLE Antenna
- Title
- File
- PCB
- Rev.
- Size
- A3
- Date
- Drawn by
- Sheet
- of

### Library data of the parts
ANT1 = ANT_Bluetury: PCB ANTENNA; Código Tury: AMOSTRA; Tipo de Montagem: SMD
C13 = CAP_0402 1nF 5% 50V X7R: CAPACITOR 0402 1NF / 50V C0G 5%; Partnumber Fabricante 01: GRT1555C1H102JA02D; Código Tury: 002.00.00004; Tipo de Montagem: SMD; Fabricante 01: MURATA; Fabricante 02: SAMSUNGEM; Fabricante 03: YAGEO; Partnumber Fabricante 02: CL05B102KB5NNNC; Partnumber Fabricante 03: CC0402JRNP09BN102
C14 = CAP_0402 1uF 10% 16V X6S: CAPACITOR 0402 1UF / 16V X6S 10%; Partnumber Fabricante 01: EMK105C6105KV-F; Código Tury: 002.00.00009; Tipo de Montagem: SMD; Fabricante 01: TAIYO-YUDEN; Fabricante 02: YAGEO; Fabricante 03: TDK; Partnumber Fabricante 02: CC0402KRX6S7BB105; Partnumber Fabricante 03: C1005X6S1C105K050BC
C15 = CAP_0402 10uF 20% 6V3 X6S: CAPACITOR 0402 10UF / 6.3V X6S 20%; Partnumber Fabricante 01: GRM155C80J106ME11D; Código Tury: 002.00.00010; Encapsulamento: 0402; Tipo de Montagem: SMD; Fabricante 01: MURATA
C16 C18 C20 C21 C24 C27 = CAP_0402 100nF 10% 50V X7R: as C1 on sheet BLUENRG-345_REV1_Sheet1; Partnumber Fabricante 02: CC0402KRX5R9BB104
C17 C19 = CAP_0402 3pF 10% 25V C0G: CAPACITOR 0402 3pF / 25V C0G; Partnumber Fabricante 01: VJ0402D3R0BXCAJ; Código Tury: 002.00.00024; Tipo de Montagem: SMD; Fabricante 01: VISHAY; Fabricante 02: KEMET
C22 C26 = CAP_0402 4,7uF 10% 50V X7R1: CAPACITOR 0402 4,7uF / 50V X7R 10%; Código Tury: 002.00.00022; Tipo de Montagem: SMD
C23 = CAP_0402 220nF 10% 16V X7R: as C6 on sheet BLUENRG-345_REV1_Sheet2; Partnumber Fabricante 02: CC0402KRX7R8BB224; Partnumber Fabricante 03: UMK105BJ224KV-F
C25 = CAP_0402 10nF 5% 25V X7R: CAPACITOR 0402 10NF / 25V X7R 5%; Partnumber Fabricante 01: GRM155R71E103JA01J; Código Tury: 002.00.00007; Tipo de Montagem: SMD; Fabricante 01: MURATA; Fabricante 02: YAGEO; Fabricante 03: YAGEO; Partnumber Fabricante 02: CC0402KRX7R8BB103; Partnumber Fabricante 03: CC0402JRX7R8BB103
C28 = CAP_0402 3,4pF 10% 25V C0G_: CAPACITOR 0402 3,4pF / 25V C0G; Partnumber Fabricante 01: GRM1555C1E3R4BA01D; Código Tury: 002.00.00026; Tipo de Montagem: SMD; Fabricante 01: MURATA
C29 = CAP_0402 1,2pF 10% 25V C0G: CAPACITOR 0402 1,2pF / 25V C0G; Partnumber Fabricante 01: VJ0402A1R2BXXCW1BC; Código Tury: 002.00.00025; Tipo de Montagem: SMD; Fabricante 01: Vishay; Fabricante 02: KYOCERA AVX; Partnumber Fabricante 02: 04023J1R2ABSTR
C30 = CAP_0402 0,5pF 5% 50V C0G: CAPACITOR 0402 0,5PF / 50V C0G 5%; Partnumber Fabricante 01: CC0402BRNPO9BNR50; Código Tury: 002.00.00023; Tipo de Montagem: SMD; Fabricante 01: Yageo; Fabricante 02: KEMET; Partnumber Fabricante 02: C0402C508C5GACTU
C31 = C0603: Capacitor
CI3 = CI_BU30TD3WG_SSOP5: CI ANALÓGICO REG DE TENSÃO  BU30TD3WG SSOP5; Código Tury: 004.02.00014; Tipo de Montagem: SMD; Fabricante 01: ROHM; Encapsulamento: SSOP5; Partnumber Fabricante 01: BU30TD3WG
CI4 = CI_BLUENRG-345: CI MICROCOTROLADOR BLUENRG-345AC; Código Tury: 004.07.00052; Value: BLUENRG-345AC
L1 = IND 0402 22nH: MICRO INDUTOR SMD 0402 22nH; Partnumber Fabricante 01: LQG15WH22NH02D; Código Tury: 003.02.00015; Encapsulamento: 0402; Fabricante 01: MURATA; Tipo de Montagem: SMD
L2 = IND 0603 10uH: MICRO INDUTOR  SMD 0603 10uH; Partnumber Fabricante 01: MLZ1608N100LT000; Encapsulamento: 0603; Código Tury: 003.02.00010; Fabricante 01: TDK; Tipo de Montagem: SMD
L3 = IND 0402 3n9H: MICRO INDUTOR SMD 0402 3,9nH; Partnumber Fabricante 01: LQG15HS3N9S02D; Código Tury: 003.02.00007; Encapsulamento: 0402; Fabricante 01: MURATA; Tipo de Montagem: SMD
L4 = RES 0402 0R 1/16W 5%: as R23 on sheet BLUENRG-345_REV1_Sheet2; Partnumber Fabricante 02: MR04X000PTL
R7 = RES 0402 10K 1/16W 5%: RESISTOR 0402 10K 1/16W 5%; Partnumber Fabricante 01: CRCW040210K0JNED; Código Tury: 001.00.00007; Encapsulamento: 0402; Tipo de Montagem: SMD; Fabricante 01: VISHAY; Fabricante 02: VIKING; Fabricante 03: WALSIN; Partnumber Fabricante 02: CR-02JL6---10K; Partnumber Fabricante 03: WR04X103JTL
R8 = RES 0402 100K 1/16W 5%: as R12 on sheet BLUENRG-345_REV1_Sheet2; Partnumber Fabricante 02: CR-02JL6--100K; Partnumber Fabricante 03: WR04X104JTL
XTAL1 = XTAL_CX2016DB: CRISTAL OSCILADOR 32MHZ SMD; Partnumber Fabricante 01: CX2016DB32000H0WRRC1; Código Tury: 009.01.00012; Fabricante 01: AVX; Fabricante 02: KYOCERA; Tipo de Montagem: SMD; Partnumber Fabricante 02: CX2016DB32000H0FLJC1; Encapsulamento: CX2016DB

## Nets that join several sheets
+3V: BLUENRG-345_REV1_Sheet1 (CN4.1 R3.2 R27.1), BLUENRG-345_REV1_Sheet3 (15 pins)
+5V: BLUENRG-345_REV1_Sheet1 (9 pins), BLUENRG-345_REV1_Sheet2 (C12.2 CI2.8), BLUENRG-345_REV1_Sheet3 (C13.2 C14.2 CI3.1 CI3.3)
GND: BLUENRG-345_REV1_Sheet1 (5 pins), BLUENRG-345_REV1_Sheet2 (R18.1 T2.2), BLUENRG-345_REV1_Sheet3 (25 pins)
GNDD: BLUENRG-345_REV1_Sheet1 (10 pins), BLUENRG-345_REV1_Sheet2 (12 pins)
LOCK_IN: BLUENRG-345_REV1_Sheet1 (CI1.10 D5.1 R27.2), BLUENRG-345_REV1_Sheet3 (CI4.10)
PWM_TPS1_OUT1: BLUENRG-345_REV1_Sheet1 (CI1.1), BLUENRG-345_REV1_Sheet2 (R9.1)
PWM_TPS1_OUT2: BLUENRG-345_REV1_Sheet1 (CI1.14), BLUENRG-345_REV1_Sheet2 (R5.1)
PWM_TPS2_OUT: BLUENRG-345_REV1_Sheet1 (CI1.13), BLUENRG-345_REV1_Sheet2 (R14.1 R17.1)
RX_UART: BLUENRG-345_REV1_Sheet1 (D2.1), BLUENRG-345_REV1_Sheet3 (CI4.8)
SWCLK: BLUENRG-345_REV1_Sheet1 (CN4.2), BLUENRG-345_REV1_Sheet3 (CI4.12)
SWDIO: BLUENRG-345_REV1_Sheet1 (CN4.4), BLUENRG-345_REV1_Sheet3 (CI4.11)
TPS1_AD: BLUENRG-345_REV1_Sheet1 (CI1.19), BLUENRG-345_REV1_Sheet2 (C8.1 R13.2)
TPS1_IN: BLUENRG-345_REV1_Sheet1 (CN1.2), BLUENRG-345_REV1_Sheet2 (C7.1 D4.2 R12.2 R13.1)
TPS1_OUT: BLUENRG-345_REV1_Sheet1 (CN1.1), BLUENRG-345_REV1_Sheet2 (R11.2)
TPS1_PWM: BLUENRG-345_REV1_Sheet1 (CI1.17), BLUENRG-345_REV1_Sheet2 (D4.1)
TPS2_AD: BLUENRG-345_REV1_Sheet1 (CI1.20), BLUENRG-345_REV1_Sheet2 (C11.1 R20.2)
TPS2_IN: BLUENRG-345_REV1_Sheet1 (CN1.4), BLUENRG-345_REV1_Sheet2 (C10.1 D6.2 R19.2 R20.1)
TPS2_OUT: BLUENRG-345_REV1_Sheet1 (CN1.3), BLUENRG-345_REV1_Sheet2 (R16.2)
TPS2_PWM: BLUENRG-345_REV1_Sheet1 (CI1.16), BLUENRG-345_REV1_Sheet2 (D6.1)
TX_UART: BLUENRG-345_REV1_Sheet1 (T1.2), BLUENRG-345_REV1_Sheet3 (CI4.7)

## Assembly variants
VARIAÇÃO 1: not fitted C30 C31 C33 CN3 CN4 GP R17 R18 R24 T2